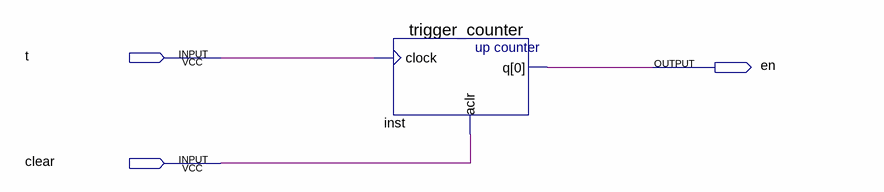
[diagram p0: schematic sheet]
// Quartus schematic trigger.bdf as structural Verilog: 1 symbols, 3 pins
module trigger (
  input  t,
  input  clear,
  output en
);

  trigger_counter inst (.clock(t), .aclr(clear), .q(en));
endmodule
